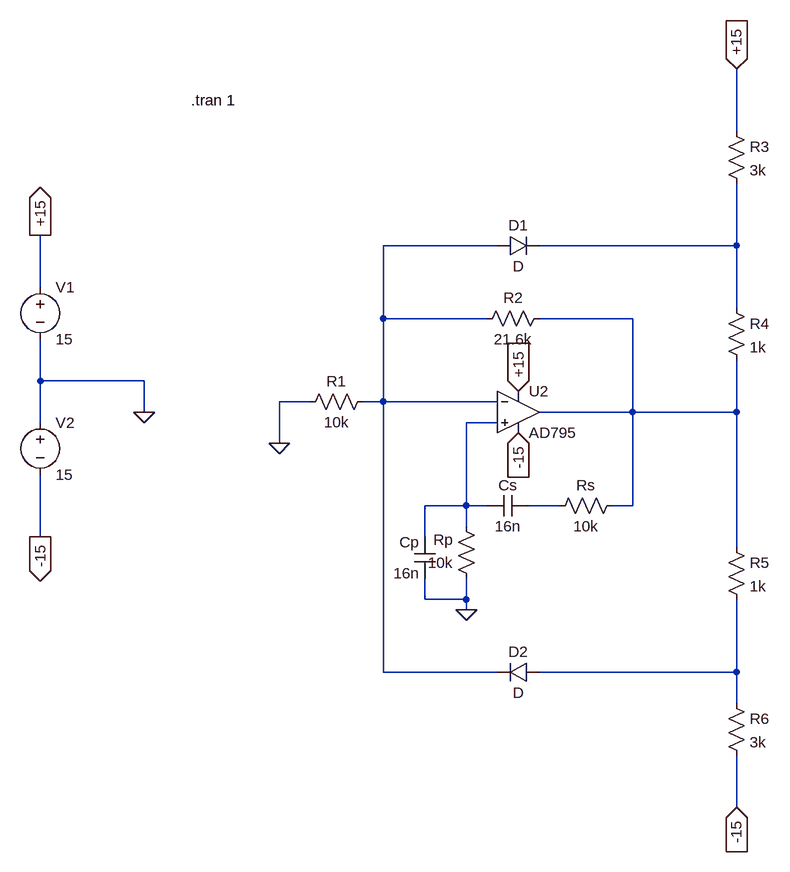
[diagram p0: schematic Oscilador_Wien.asc]
Oscilador_Wien.asc, the LTspice schematic file:
Version 4
SHEET 1 1000 912
WIRE 528 -240 528 -336
WIRE 160 -64 -16 -64
WIRE 528 -64 528 -160
WIRE 528 -64 224 -64
WIRE -544 0 -544 -80
WIRE 528 32 528 -64
WIRE -16 48 -16 -64
WIRE 144 48 -16 48
WIRE 368 48 224 48
WIRE -544 144 -544 80
WIRE -384 144 -544 144
WIRE -128 176 -176 176
WIRE -16 176 -16 48
WIRE -16 176 -48 176
WIRE 160 176 -16 176
WIRE -384 192 -384 144
WIRE 368 192 368 48
WIRE 368 192 224 192
WIRE 528 192 528 112
WIRE 528 192 368 192
WIRE -544 208 -544 144
WIRE 160 208 112 208
WIRE -176 240 -176 176
WIRE 112 336 112 208
WIRE 112 336 48 336
WIRE 144 336 112 336
WIRE 256 336 208 336
WIRE 368 336 368 192
WIRE 368 336 336 336
WIRE 112 368 112 336
WIRE -544 384 -544 288
WIRE 48 384 48 336
WIRE 528 400 528 192
WIRE 48 480 48 448
WIRE 112 480 112 448
WIRE 112 480 48 480
WIRE 112 496 112 480
WIRE -16 592 -16 176
WIRE 160 592 -16 592
WIRE 528 592 528 480
WIRE 528 592 224 592
WIRE 528 640 528 592
WIRE 528 800 528 720
FLAG 112 496 0
FLAG -176 240 0
FLAG 528 -336 +15
IOPIN 528 -336 In
FLAG 528 800 -15
IOPIN 528 800 In
FLAG -384 192 0
FLAG -544 -80 +15
IOPIN -544 -80 Out
FLAG -544 384 -15
IOPIN -544 384 Out
FLAG 192 160 +15
IOPIN 192 160 In
FLAG 192 224 -15
IOPIN 192 224 In
SYMBOL res 240 32 R90
WINDOW 0 0 56 VBottom 2
WINDOW 3 32 56 VTop 2
SYMATTR InstName R2
SYMATTR Value 21.6k
SYMBOL res -32 160 R90
WINDOW 0 0 56 VBottom 2
WINDOW 3 32 56 VTop 2
SYMATTR InstName R1
SYMATTR Value 10k
SYMBOL res 352 320 R90
WINDOW 0 0 56 VBottom 2
WINDOW 3 32 56 VTop 2
SYMATTR InstName Rs
SYMATTR Value 10k
SYMBOL res 128 464 R180
WINDOW 0 36 76 Left 2
WINDOW 3 36 40 Left 2
SYMATTR InstName Rp
SYMATTR Value 10k
SYMBOL cap 208 320 R90
WINDOW 0 0 32 VBottom 2
WINDOW 3 32 32 VTop 2
SYMATTR InstName Cs
SYMATTR Value 16n
SYMBOL cap 64 448 R180
WINDOW 0 24 56 Left 2
WINDOW 3 24 8 Left 2
SYMATTR InstName Cp
SYMATTR Value 16n
SYMBOL diode 160 -48 R270
WINDOW 0 32 32 VTop 2
WINDOW 3 0 32 VBottom 2
SYMATTR InstName D1
SYMBOL diode 224 576 R90
WINDOW 0 0 32 VBottom 2
WINDOW 3 32 32 VTop 2
SYMATTR InstName D2
SYMBOL res 512 384 R0
SYMATTR InstName R5
SYMATTR Value 1k
SYMBOL res 512 16 R0
SYMATTR InstName R4
SYMATTR Value 1k
SYMBOL res 512 -256 R0
SYMATTR InstName R3
SYMATTR Value 3k
SYMBOL res 512 624 R0
SYMATTR InstName R6
SYMATTR Value 3k
SYMBOL voltage -544 -16 R0
WINDOW 123 0 0 Left 2
WINDOW 39 24 124 Left 2
SYMATTR InstName V1
SYMATTR Value 15
SYMBOL voltage -544 192 R0
WINDOW 123 0 0 Left 2
WINDOW 39 0 0 Left 2
SYMATTR InstName V2
SYMATTR Value 15
SYMBOL Opamps\\AD795 192 128 R0
SYMATTR InstName U2
TEXT -312 -288 Left 2 !.tran 1

The netlist it stands for:
* Oscilador_Wien.asc
R2 N003 N001 21.6k
R1 N001 0 10k
Rs N003 N005 10k
Rp 0 N004 10k
Cs N005 N004 16n
Cp 0 N004 16n
D1 N001 N002 D
D2 N006 N001 D
R5 N003 N006 1k
R4 N002 N003 1k
R3 +15 N002 3k
R6 N006 -15 3k
V1 +15 0 15
V2 0 -15 15
XU2 N004 N001 +15 -15 N003 AD795  ; pins In+ In- V+ V- OUT
.model D D
.lib standard.dio
.tran 1
.lib ADI1.lib
.backanno
.end